# Altium schematic sheet GREEN LED SCH.schdoc
size 127 x 101 mm
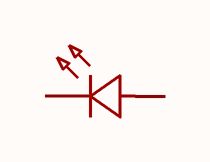
[diagram p0: GREEN LED SCH.schdoc]

## Parts
LED?  VLMG1500-GS08  [LED0402-RD_GREEN]  (value not drawn)

## Nets

Not connected (* = marked no-connect by the designer): LED? 1(K) 2(A)

## Library data of the parts
LED? = VLMG1500-GS08: Manufacturer: VISHAY(威世); Add into BOM: yes; Emitted Color: Green-yellow; Forward Voltage (VF): 2V; Forward Current: 20mA; Dominant Wavelength: 571nm; Peak Wavelength: 574nm; Luminous Intensity: 35mcd; Viewing Angle: 130°; Symbol: VLMG1500-GS08; Device: VLMG1500-GS08; LCSC Part Name: 普绿/黄绿; Supplier Part: C511404; Manufacturer Part: VLMG1500-GS08; Supplier Footprint: 0402; JLCPCB Part Class: Extended Part; Datasheet: https://atta.szlcsc.com/upload/public/pdf/source/20200408/C511042_90D3007A8FB4E63E401D7A77D5F44EFD.pdf; Supplier: LCSC; Convert to PCB: yes